# EAGLE design mini_player_v1.1 (EAGLE 9.6.2)
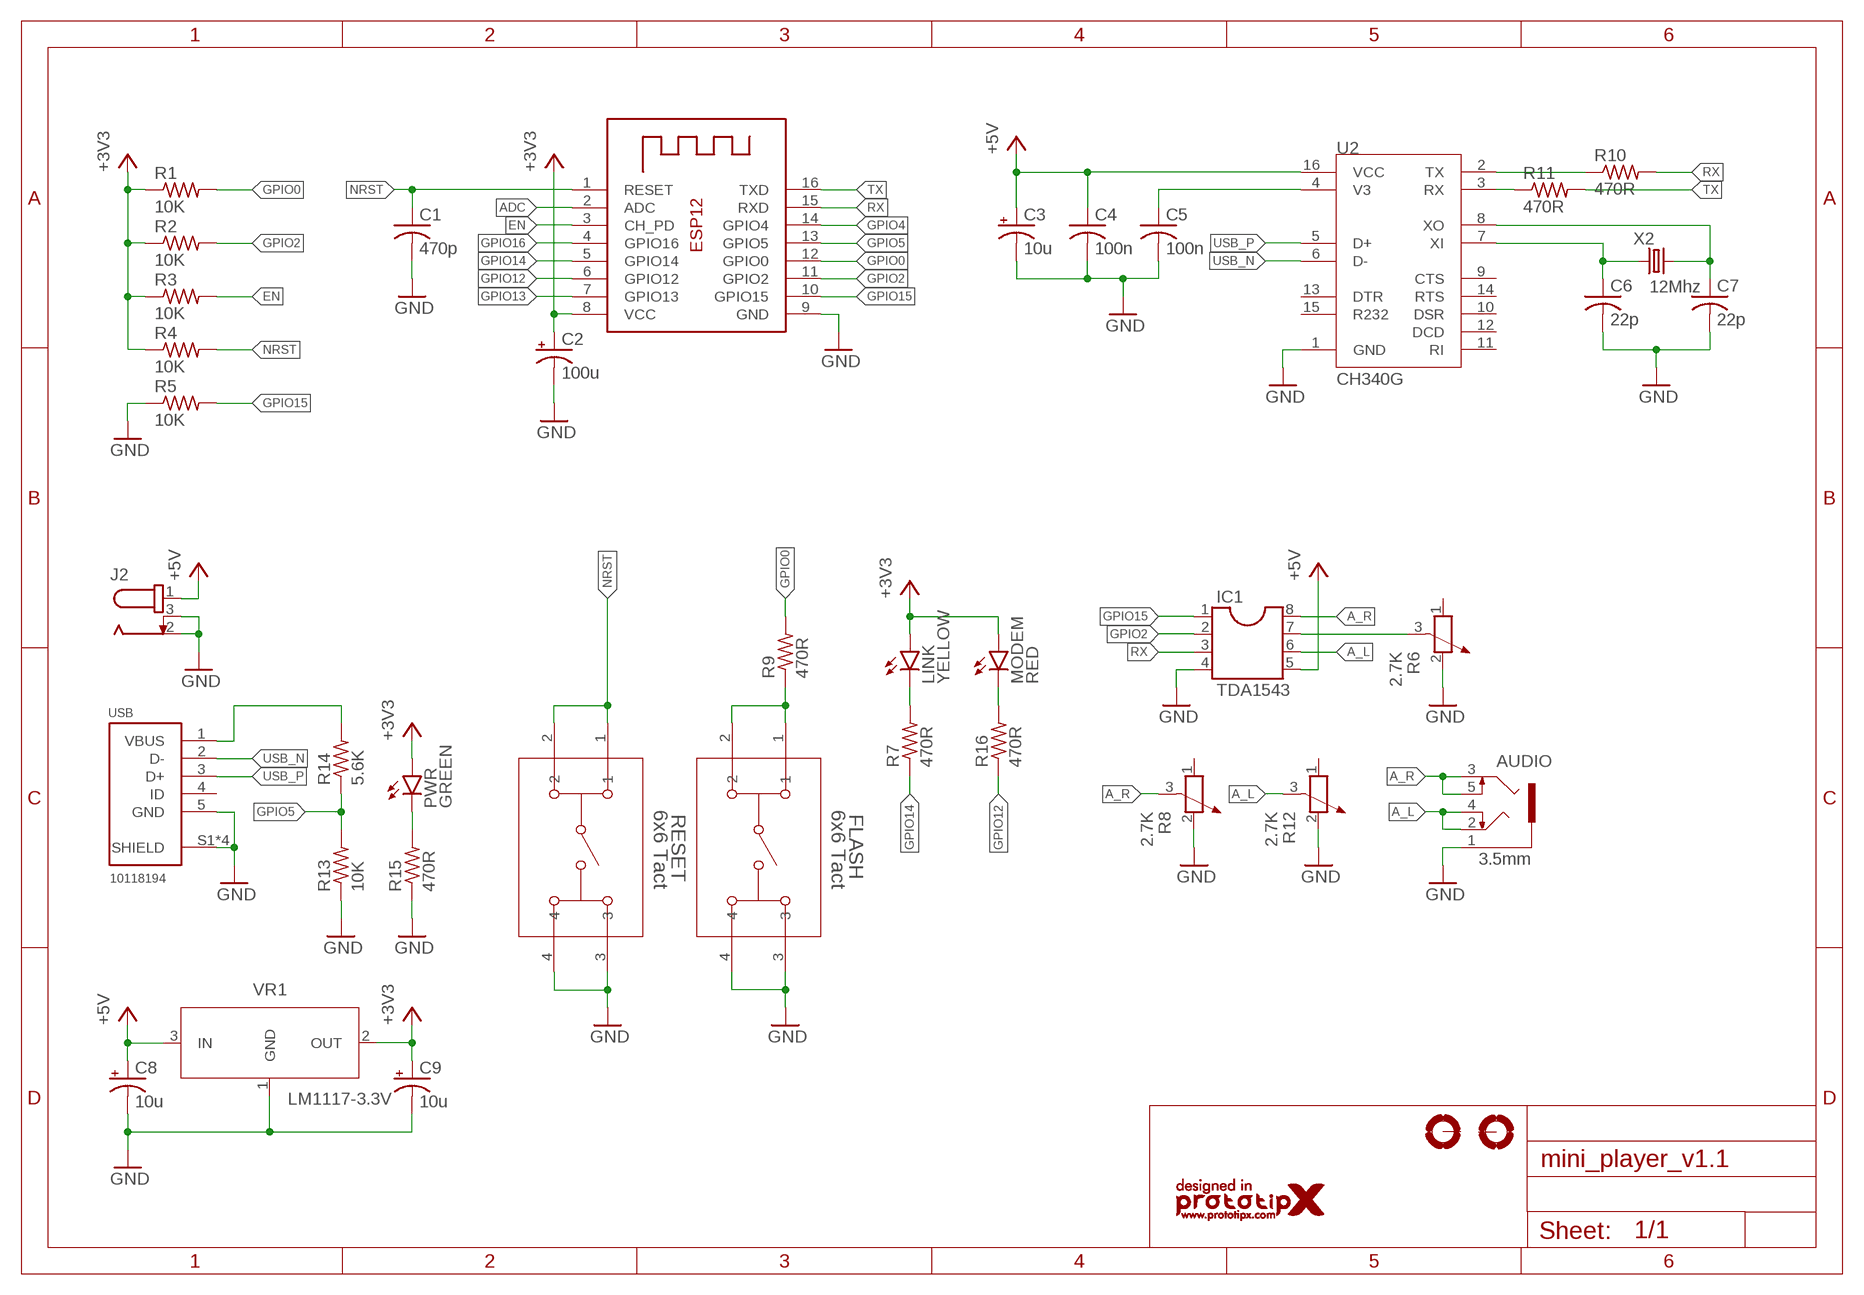
[diagram p0: schematic, sheet 1]

## Parts
AUDIO  3.5mm  1503_09  [1503_09]
C1  470p  C-USC0805  [C0805]
C2  100u  CPOL-USSMCB  [SMC_B]
C3  10u  CPOL-USSMCB  [SMC_B]
C4  100n  C-USC0805  [C0805]
C5  100n  C-USC0805  [C0805]
C6  22p  C-USC0805  [C0805]
C7  22p  C-USC0805  [C0805]
C8  10u  CPOL-USSMCB  [SMC_B]
C9  10u  CPOL-USSMCB  [SMC_B]
FLASH  6x6 Tact  2-1825910-7  [SW4_1825910-G]
H1  MOUNT-PAD-ROUND3.6  [3,6-PAD]
H2  MOUNT-PAD-ROUND3.6  [3,6-PAD]
IC1  TDA1543  DIL8  [DIL08]
J2  694106301002  [694106301002]
LINK  YELLOW  LED3MM  [LED3MM]
LOGO1  PROTOTIPXDESIGN2  [PROTOTIPX_DESING_15MM]
MODEM  RED  LED3MM  [LED3MM]
PWR  GREEN  LED3MM  [LED3MM]
R1  10K  R-US_R0805  [R0805]
R2  10K  R-US_R0805  [R0805]
R3  10K  R-US_R0805  [R0805]
R4  10K  R-US_R0805  [R0805]
R5  10K  R-US_R0805  [R0805]
R6  2.7K  POTENTIOMETER_PT-10  [PT-10]
R7  470R  R-US_R0805  [R0805]
R8  2.7K  POTENTIOMETER_PT-10  [PT-10]
R9  470R  R-US_R0805  [R0805]
R10  470R  R-US_R0805  [R0805]
R11  470R  R-US_R0805  [R0805]
R12  2.7K  POTENTIOMETER_PT-10  [PT-10]
R13  10K  R-US_R0805  [R0805]
R14  5.6K  R-US_R0805  [R0805]
R15  470R  R-US_R0805  [R0805]
R16  470R  R-US_R0805  [R0805]
RESET  6x6 Tact  2-1825910-7  [SW4_1825910-G]
U1  ESP12E  ESP-12  [ESP-12]
U2  CH340G  [SOIC16]
USB  10118194  MICRO_USB  [10118194]
VR1  LM1117-3.3V  NCP1117ST33T3GSOT-223  [SOT230P700X170-4]
X2  12Mhz  5032/2P  [5032/2P]

## Nets
+3V3: C2.+ C9.+ LINK.A MODEM.A PWR.A R1.1 R2.1 R3.1 R4.1 U1.8(VCC) VR1.2(OUT)
+5V: C3.+ C4.1 C8.+ IC1.5 J2.1 U2.16(VCC) VR1.3(IN)
A_L: AUDIO.2 AUDIO.4 IC1.6 R12.3
A_R: AUDIO.3 AUDIO.5 IC1.8 R8.3
ADC: U1.2(ADC)
EN: R3.2 U1.3(CH_PD)
GND: AUDIO.1 C1.2 C2.- C3.- C4.2 C5.2 C6.2 C7.2 C8.- C9.- FLASH.3 FLASH.4 IC1.4 J2.2 J2.3 R5.1 R6.2 R8.2 R12.2 R13.1 R15.1 RESET.3 RESET.4 U1.9(GND) U2.1(GND) USB.5(GND) USB.S1(SHIELD) USB.S2(SHIELD) USB.S3(SHIELD) USB.S6(SHIELD) VR1.1(GND)
GPIO0: R1.2 R9.2 U1.12(GPIO0)
GPIO2: IC1.2 R2.2 U1.11(GPIO2)
GPIO4: U1.14(GPIO4)
GPIO5: R13.2 R14.1 U1.13(GPIO5)
GPIO12: R16.1 U1.6(GPIO12)
GPIO13: U1.7(GPIO13)
GPIO14: R7.1 U1.5(GPIO14)
GPIO15: IC1.1 R5.2 U1.10(GPIO15)
GPIO16: U1.4(GPIO16)
N$1: R14.2 USB.1(VBUS)
N$3: FLASH.1 FLASH.2 R9.1
N$4: C5.1 U2.4(V3)
N$6: C6.1 U2.7(XI) X2.1
N$7: C7.1 U2.8(XO) X2.2
N$9: R11.1 U2.3(RX)
N$10: R10.1 U2.2(TX)
N$11: MODEM.K(C) R16.2
N$14: PWR.K(C) R15.2
N$15: LINK.K(C) R7.2
NRST: C1.1 R4.2 RESET.1 RESET.2 U1.1(RESET)
RX: IC1.3 R10.2 U1.15(RXD)
TX: R11.2 U1.16(TXD)
USB_N: U2.6(D-) USB.2(D-)
USB_P: U2.5(D+) USB.3(D+)
VREF: IC1.7 R6.3
Unconnected: H1.B3,6(MOUNT) H2.B3,6(MOUNT) R6.1 R8.1 R12.1 U2.9(CTS) U2.10(DSR) U2.11(RI) U2.12(DCD) U2.13(DTR) U2.14(RTS) U2.15(R232) USB.4(ID)

## Library data of the parts
AUDIO = con-lumberg:1503_09: Jack connectors according to JISC 6560, 3.5 mm Klinkeneinbaukupplung nach JISC 6560, 3,5 mm, 3-polig/ stereo, abgewinkelte Ausführung, mit 2 Öffnern und Lötaugen, für Leiterplatten Rückseitenmontage Source: http://www.lumberg.com/Produkte/PDFs/1503_09.pdf; OC_FARNELL: 1243244; OC_NEWARK: unknown
C1 C4-C7 = rcl:C-US: CAPACITOR, American symbol; SPICEPREFIX: C
C2 C3 C8 C9 = rcl:CPOL-US: POLARIZED CAPACITOR, American symbol; SPICEPREFIX: C
FLASH RESET = Switches:2-1825910-7; BUILT_BY: EMA_UL_Team; CATEGORY: Tactile Switches; CONFIGURATION__POLE-THROW_: Single Pole - Single Throw; COPYRIGHT: Copyright (C) 2016 Accelerated Designs. All rights reserved; DESCRIPTION: FSM14JH=6MM TACT SWITCH, HIGH TEMP; MANUFACTURER_PART_NUMBER: 2-1825910-7; MAX_SWITCHING_CURRENT: -; MAX_SWITCHING_VOLTAGE_AC_: -; PART_STATUS: active; PRODUCT_TYPE: Switch; SERIES: Unknown; SWITCH_TYPE: Tactile Switches; TE_PART_NUMBER: 2-1825910-7; VENDOR: TE Connectivity
H1 H2 = holes:MOUNT-PAD-ROUND: MOUNTING PAD, round
IC1 = ic-package:DIL8: Dual In Line / Socket
J2 = DC Power Jacks:694106301002: CONN PWR JACK 2.1X5.5MM SOLDER Manufacturer's datasheet <https://katalog.we-online.de/em/datasheet/6941xx301002.pdf>; CREATED_BY: PCBLayout.com; DIGIKEY_PART_NUMBER: 732-5930-ND; MANUFACTURER: Wurth Electronics Inc.; MPN: 694106301002
LINK MODEM PWR = led:LED: LED OSRAM: - CHIPLED LG R971, LG N971, LY N971, LG Q971, LY Q971, LO R971, LY R971 LH N974, LH R974 LS Q976, LO Q976, LY Q976 LO Q996 - Hyper CHIPLED LW Q18S LB Q993, LB Q99A, LB R99A - SideLED LS A670, LO A670, LY A670, LG A670, LP A670 LB A673, LV A673, LT A673, LW A673 LH A674 LY A675 LS A676, LA A676, LO A676, LY A676, LW A676 LS A679, LY A679, LG A679 - Hyper Micro SIDELED® LS Y876, LA Y876, LO Y876, LY Y876 LT Y87S - SmartLED LW L88C, LW L88S LB L89C, LB L89S, LG L890 LS L89K, LO L89K, LY L89K LS L896, LA L896, LO L896, LY L896 - TOPLED LS T670, LO T670, LY T670, LG T670, LP T670 LSG T670, LSP T670, LSY T670, LOP T670, LYG T670 LG T671, LOG T671, LSG T671 LB T673, LV T673, LT T673, LW T673 LH T674 LS T676, LA T676, LO T676, LY T676, LB T676, LH T676, LSB T676, LW T676 LB T67C, LV T67C, LT T67C, LS T67K, LO T67K, LY T67K, LW E67C LS E67B, LA E67B, LO E67B, LY E67B, LB E67C, LV E67C, LT E67C LW T67C LS T679, LY T679, LG T679 LS T770, LO T770, LY T770, LG T770, LP T770 LB T773, LV T773, LT T773, LW T773 LH T774 LS E675, LA E675, LY E675, LS T675 LS T776, LA T776, LO T776, LY T776, LB T776 LHGB T686 LT T68C, LB T68C - Hyper Mini TOPLED® LB M676 - Mini TOPLED Santana® LG M470 LS M47K, LO M47K, LY M47K Source: http://www.osram.convergy.de LUXEON: - LUMILED® LXK2-PW12-R00, LXK2-PW12-S00, LXK2-PW14-U00, LXK2-PW14-V00 LXK2-PM12-R00, LXK2-PM12-S00, LXK2-PM14-U00 LXK2-PE12-Q00, LXK2-PE12-R00, LXK2-PE12-S00, LXK2-PE14-T00, LXK2-PE14-U00 LXK2-PB12-K00, LXK2-PB12-L00, LXK2-PB12-M00, LXK2-PB14-N00, LXK2-PB14-P00, LXK2-PB14-Q00 LXK2-PR12-L00, LXK2-PR12-M00, LXK2-PR14-Q00, LXK2-PR14-R00 LXK2-PD12-Q00, LXK2-PD12-R00, LXK2-PD12-S00 LXK2-PH12-R00, LXK2-PH12-S00 LXK2-PL12-P00, LXK2-PL12-Q00, LXK2-PL12-R00 Source: www.luxeon.com KINGBRIGHT: KA-3528ASYC Source: www.kingbright.com
LOGO1 = 1-my-library:PROTOTIPX
R1-R5 R7 R9-R11 R13-R16 = rcl:R-US_: RESISTOR, American symbol; SPICEPREFIX: R
R6 R8 R12 = rcl:POTENTIOMETER_: Potentiometer; SPICEMODEL: POT; SPICEPREFIX: X
U1 = adafruit:ESP-12
U2 = 1-my-library:CH340G
USB = 1-my-library:MICRO_USB: CONN RCPT USB2.0 MICRO B SMD R/A Manufacturer's datasheet <https://www.amphenol-icc.com/media/wysiwyg/files/drawing/10118194.pdf?__cf_chl_jschl_tk__=1e9b4569481076e99900b246ea640525553a7b60-1588047333-0-AZhEk6D50lwOf6CdaXmV1teudqMKHMxqtb1pEtnUtu77sOc-OVRjbCmHdORomVnr0W49D2E8XkcMdJ2SdWt5rDDYIblyJz7fSv-zilM8vQKAQDC1Z9aMVORhnMgYjPDuz8XpfDLul_eaqqFpemo1xIgoZv50WTuLMwu26ci7e02s9PWvR3z1cDqm9GMGYIPwIUd9yh5-TtN_o6DbEkadC7zoJlhYZSw-VEaYzfWnBSFg_n44fbEB3slHLR2YKLSiTmh8RSwpxKUP4gER0KeVoie9w-Ibtx3oKQbsZjrsPLGSu9BzV2nf3QeoErALCQuycvY9WhQdebLIpxaon6SXufpVIIdoKZHRpjuVVlAkUIr9oSIZGQzzOWY1-dWY48jVEOvnvoxw9-xup5uFcr7XWo0>; CREATED_BY: PCBLayout.com; DIGIKEY_PARTNO: 609-4618-2-ND; MANUFACTURER: Amphenol ICC (FCI); MPN: 10118194-0001LF
VR1 = IC_Power-Management:NCP1117ST33T3G: 1.0 A Low-Dropout Positive Fixed and Adjustable Voltage Regulators Datasheet <https://www.onsemi.com/pub/Collateral/NCP1117-D.PDF>; CATEGORY: IC_Power-Management; MANUFACTURER: ON Semiconductor; MPN: NCP1117ST33T3G; OPERATING_TEMP: 0 to +125 °C; PART_STATUS: Active; ROHS_COMPLIANT: RoHS3 Compliant; SERIES: NCP1117, NCV1117; SUB-CATEGORY: Voltage Regulator; TYPE: Linear; VALUE: NCP1117ST33T3G
X2 = Crystals:5032/2P: Crystal Manufacturer's datasheet <https://datasheet.octopart.com/5032-2P-Xinhunjing-datasheet-30677175.pdf>; CREATED_BY: PCBLayout.com; MANUFACTURER: Xinhunjing; MPN: 5032/2P; PACKAGE: SMD

## Board
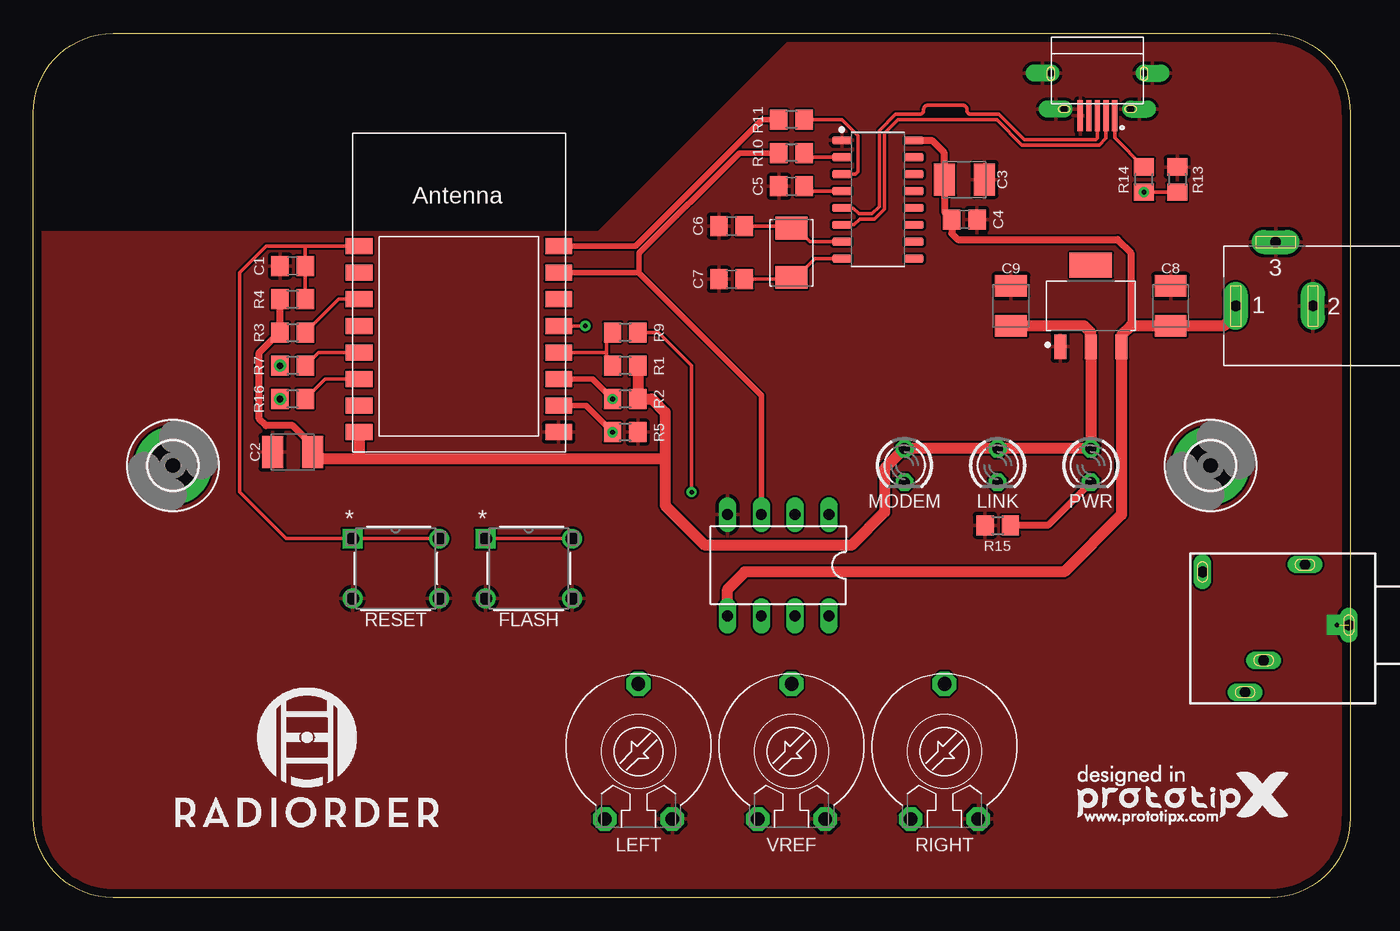
[diagram p1: board, top side]
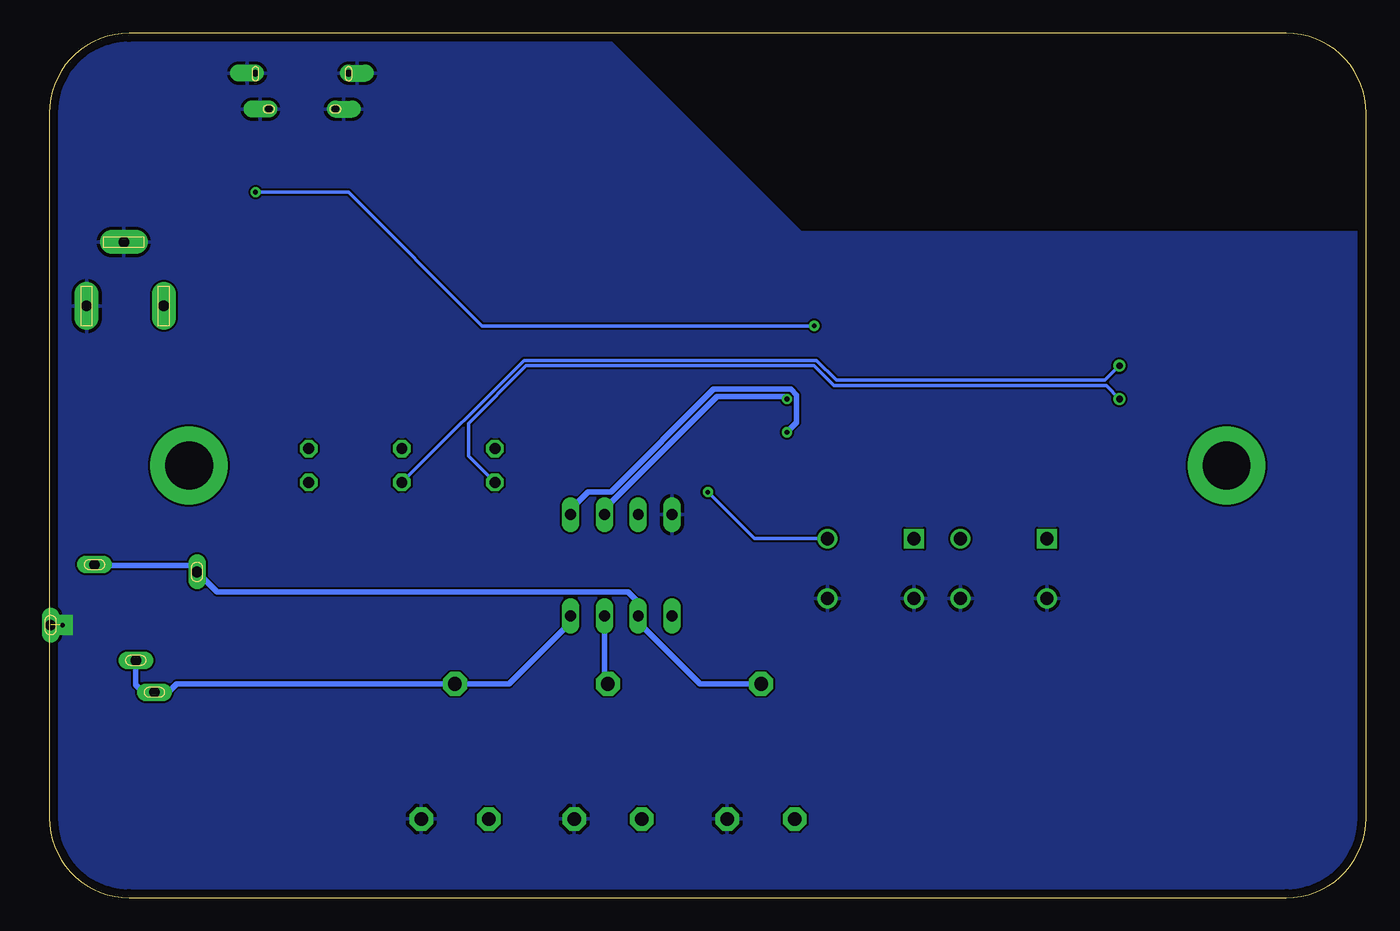
[diagram p2: board, bottom side, seen from below]

Size 99 x 65 mm. Coordinates in mm from the lower left corner, seen from the top.
Outline: 99,59 99,6 arc-90 93,0 6,0 arc-90 0,6 0,59 arc-90 6,65 93,65 arc-90 99,59
Copper layers (1*16): Top 0.035mm / dielectric 1.5mm / Bottom 0.035mm
Design rules "default *": minimum track width 6mil, minimum drill 0.35mm, track to track 6mil, track to pad 6mil, pad to pad 6mil, via to via 6mil, smd to smd 6mil, copper to edge 25mil, drill to drill 6mil, minimum pad ring 10mil, minimum via ring 8mil, stop-mask expansion 4mil, vias tented up to drill 0mil, thermal gap 10mil

### Footprints (pad centres in the part's own frame; a part is rotated, then mirrored left to right if it is on the bottom)
1503_09 = drill 0.8 pad 1.2 long: 1 0,-2.1; 2 -4.55,-5.4; 3 5.05,-9.9; 4 -4,-13.1; 5 2.65,-8.5
C0805 = smd 1.3 x 1.5: 1 -0.95,0; 2 0.95,0
SMC_B = smd 1.6 x 2.4: + -1.5,0; - 1.5,0
SW4_1825910-G = drill 0.991 pad 1.499 square: 1 -6.502,4.496 | drill 0.991 pad 1.499: 2 0,4.496; 3 -6.502,0; 4 0,0
3,6-PAD = drill 3.6 pad 5.842: B3,6 0,0
DIL08 = drill 0.813 long: 1 -3.81,-3.81; 2 -1.27,-3.81; 3 1.27,-3.81; 4 3.81,-3.81; 5 3.81,3.81; 6 1.27,3.81; 7 -1.27,3.81; 8 -3.81,3.81
694106301002 = drill 0.8 pad 1.8 long: 1 13.6,0; 2 7.8,0; 3 10.6,-4.8
LED3MM = drill 0.813 octagon: A -1.27,0; K 1.27,0
R0805 = smd 1.3 x 1.5: 1 -0.95,0; 2 0.95,0
PT-10 = drill 1.016 pad 1.778 octagon: 1 -2.54,-5.08; 2 2.54,-5.08; 3 0,5.08
ESP-12 = smd 2 x 1.2: 1 -7.5,4.5; 2 -7.5,2.5; 3 -7.5,0.5; 4 -7.5,-1.5; 5 -7.5,-3.5; 6 -7.5,-5.5; 7 -7.5,-7.5; 8 -7.5,-9.5; 9 7.5,-9.5; 10 7.5,-7.5; 11 7.5,-5.5; 12 7.5,-3.5; 13 7.5,-1.5; 14 7.5,0.5; 15 7.5,2.5; 16 7.5,4.5
SOIC16 = smd 1.485 x 0.605: 1 -2.715,4.445; 2 -2.715,3.175; 3 -2.715,1.905; 4 -2.715,0.635; 5 -2.715,-0.635; 6 -2.715,-1.905; 7 -2.715,-3.175; 8 -2.715,-4.445; 9 2.715,-4.445; 10 2.715,-3.175; 11 2.715,-1.905; 12 2.715,-0.635; 13 2.715,0.635; 14 2.715,1.905; 15 2.715,3.175; 16 2.715,4.445
10118194 = smd 0.4 x 2.35: 1 -1.3,3.2; 2 -0.65,3.2; 3 0,3.2; 4 0.65,3.2; 5 1.3,3.2 | drill 0.55 pad 1.27 offset: S1 -2.5,2.7; S2 2.5,2.7 | drill 0.5 pad 1.27 offset: S3 -3.5,0; S6 3.5,0
SOT230P700X170-4 = smd 1.86 x 0.898: 1 -3.075,2.3; 2 -3.075,0; 3 -3.075,-2.3 | smd 1.86 x 3.189: 4 3.075,0
5032/2P = smd 1.7 x 2.4: 1 -1.85,0; 2 1.85,0

### Placement (x,y rotation side)
AUDIO  101,20.5 270 top
C1  19.5,47.5 180 top
C2  19.5,33.5 180 top
C3  70,54 0 top
C4  70,51 0 top
C5  57,53.5 180 top
C6  52.5,50.5 180 top
C7  52.5,46.5 180 top
C8  85.5,44.5 90 top
C9  73.5,44.5 90 top
FLASH  40.5,22.5 0 top
H1  10.5,32.5 0 top
H2  88.5,32.5 0 top
IC1  56,25 180 top
J2  104,44.5 180 top
LINK  72.5,32.5 270 top
LOGO1  78.5,5.5 0 top
MODEM  65.5,32.5 270 top
PWR  79.5,32.5 270 top
R1  44.5,40 180 top
R2  44.5,37.5 180 top
R3  19.5,42.5 0 top
R4  19.5,45 0 top
R5  44.5,35 180 top
R6  57,11 0 top
R7  19.5,40 180 top
R8  68.5,11 0 top
R9  44.5,42.5 180 top
R10  57,56 180 top
R11  57,58.5 180 top
R12  45.5,11 0 top
R13  86,54 270 top
R14  83.5,54 90 top
R15  72.5,28 0 top
R16  19.5,37.5 180 top
RESET  30.5,22.5 0 top
U1  32,44.5 0 top
U2  63.5,52.5 0 top
USB  80,62 180 top
VR1  79.5,44.5 90 top
X2  57,48.5 270 top

### Tracks (layer width: path | path; a pad name or v marks a point on that pad's centre or on a via)
+3V3
  Top 0.508: R4.1 R3.1 18.5,42.5 17,41 17,36 17.5,35.5 19.5,35.5 20.5,34.5 20.5,34 C2.+
  Top 0.813: C9.+ 79,43 79.5,42.5 VR1.2 PWR.A LINK.A MODEM.A 64,32.27 64,29 61.5,26.5 50.5,26.5 47.5,29.5 47.5,33 | U1.8 24.5,33 | R1.1 R2.1 46.5,37.5 47.5,36.5 47.5,33 | 47.5,33 24.5,33 | 24.5,33 21.5,33 C2.+
+5V
  Top 0.508: U2.16 67.56,56.95 68.44,56.05 68.44,53.95 C3.+ 68.5,51.55 C4.1 69.05,49.95 69.5,49.5 81.5,49.5 82.5,48.5 82.5,43
  Top 0.813: J2.1 90.4,43.9 89.5,43 C8.+ 82.5,43 81.8,42.3 VR1.3 81.8,28.8 77.5,24.5 53.5,24.5 52.19,23.19 IC1.5
A_L
  Bottom 0.406: R12.3 50.08,16.08 54.73,20.73 IC1.6 54.73,22.23 55.5,23 86.4,23 AUDIO.4 88.4,25 95.55,25 AUDIO.2
A_R
  Bottom 0.406: IC1.8 59.81,20.69 64.42,16.08 R8.3 89.42,16.08 90.05,15.45 AUDIO.3 91.95,15.45 92.5,16 AUDIO.5
EN
  Top 0.254: R3.2 22.95,45 U1.3
GND  (via drill 0.35 pad 1.5)  (1 unrouted)
  Bottom 0.406: v98,20.5 98.16,20.5
  pour Bottom: 0,50 0,0 99,0 99,65 57.5,65 42.5,50
  pour Top: 0,50 0,0 99,0 99,65 57.5,65 42.5,50
GPIO0
  Top 0.254: R1.2 43.1,40.45 43.1,41 | R9.2 43.1,42.05 43.1,41 | U1.12 43.1,41
GPIO2  (via drill 0.35)
  Top 0.254: 43.52,37.52 R2.2
  Top 0.406: U1.11 42.05,39 43.52,37.52
  Bottom 0.406: IC1.2 57.27,29.23 48.83,37.67 43.73,37.67 R2.2
  other vias: 43.55,37.5
GPIO5  (via drill 0.35)
  Top 0.254: R13.2 R14.1 | v41.5,43 U1.13
  Bottom 0.254: R14.1 76.5,53.05 66.45,43 v41.5,43
  other vias: 83.5,53.05
GPIO12
  Top 0.254: R16.1 21.95,39 U1.6
GPIO14
  Top 0.254: R7.1 21.45,41 U1.5
GPIO15  (via drill 0.35)
  Top 0.406: U1.10 41.55,37 R5.2
  Bottom 0.406: IC1.1 59.81,29.19 58.5,30.5 56.79,30.5 49.06,38.23 43.25,38.23 42.82,37.8 42.82,35.73 R5.2
  other vias: 43.55,35
N$1
  Top 0.254: R14.2 81.3,57.15 USB.1
N$3  (via drill 0.35)
  Top 0.254: FLASH.1 FLASH.2 | R9.1 47,42.5 49.5,40 v49.5,30.5
  Bottom 0.254: v49.5,30.5 46,27 FLASH.2
N$4
  Top 0.254: U2.4 58.31,53.14 C5.1
N$6
  Top 0.254: C6.1 56.85,50.5 X2.1 57.35,50.35 58.38,49.33 U2.7
N$7
  Top 0.254: C7.1 56.85,46.5 X2.2 57.35,46.65 58.76,48.05 U2.8
N$9
  Top 0.254: U2.3 61.8,54.41 62,54.6 62,57.3 60.8,58.5 R11.1
N$10
  Top 0.254: U2.2 58.27,55.67 R10.1
N$11  (via drill 0.5)
  Bottom 0.254: R16.2 19.55,38.5 40,38.5 41.5,40 63.16,40 67.5,35.66 67.5,33.23 MODEM.K
  other vias: 18.55,37.5
N$14
  Top 0.508: PWR.K 76.27,28 R15.2
N$15  (via drill 0.5)
  Bottom 0.254: LINK.K 63.32,40.41 41.33,40.41 39.83,38.91 19.64,38.91 R7.2
  other vias: 18.55,40
NRST
  Top 0.254: 20.45,49 C1.1 R4.2 | U1.1 20.45,49 | RESET.2 26.5,27 RESET.1 19,27 15.5,30.5 15.5,47 17.5,49 20.45,49
RX
  Top 0.406: U1.15 45.5,47 | IC1.3 54.73,37.77 45.5,47 | 45.5,47 45.54,47.04 45.54,48.46 53.08,56 R10.2
TX
  Top 0.406: R11.2 54.78,58.5 45.28,49 U1.16
USB_N
  Top 0.254: USB.2 80.65,57.12 80.13,56.59 74.33,56.59 72.42,58.5 65,58.5 64,57.5 64,51.79 63.23,51.03 62.13,51.03 61.7,50.59 U2.6
USB_P
  Top 0.254: USB.3 80,57.12 79.88,57 74.5,57 72.59,58.91 70.5,58.91 arc-90 70.18,59.22 70.18,59.27 arc90 69.87,59.59 67.25,59.59 arc90 66.93,59.27 66.93,59.22 arc-90 66.62,58.91 64.83,58.91 63.59,57.67 63.59,51.96 63.06,51.43 62.07,51.43 61.63,51.86 U2.5
VREF
  Bottom 0.406: IC1.7 57.27,16.35 R6.3

### Text on the board
tNames: LEFT | VREF | RIGHT